# Altium schematic sheet BRD220522.schdoc
size 412 x 216 mm
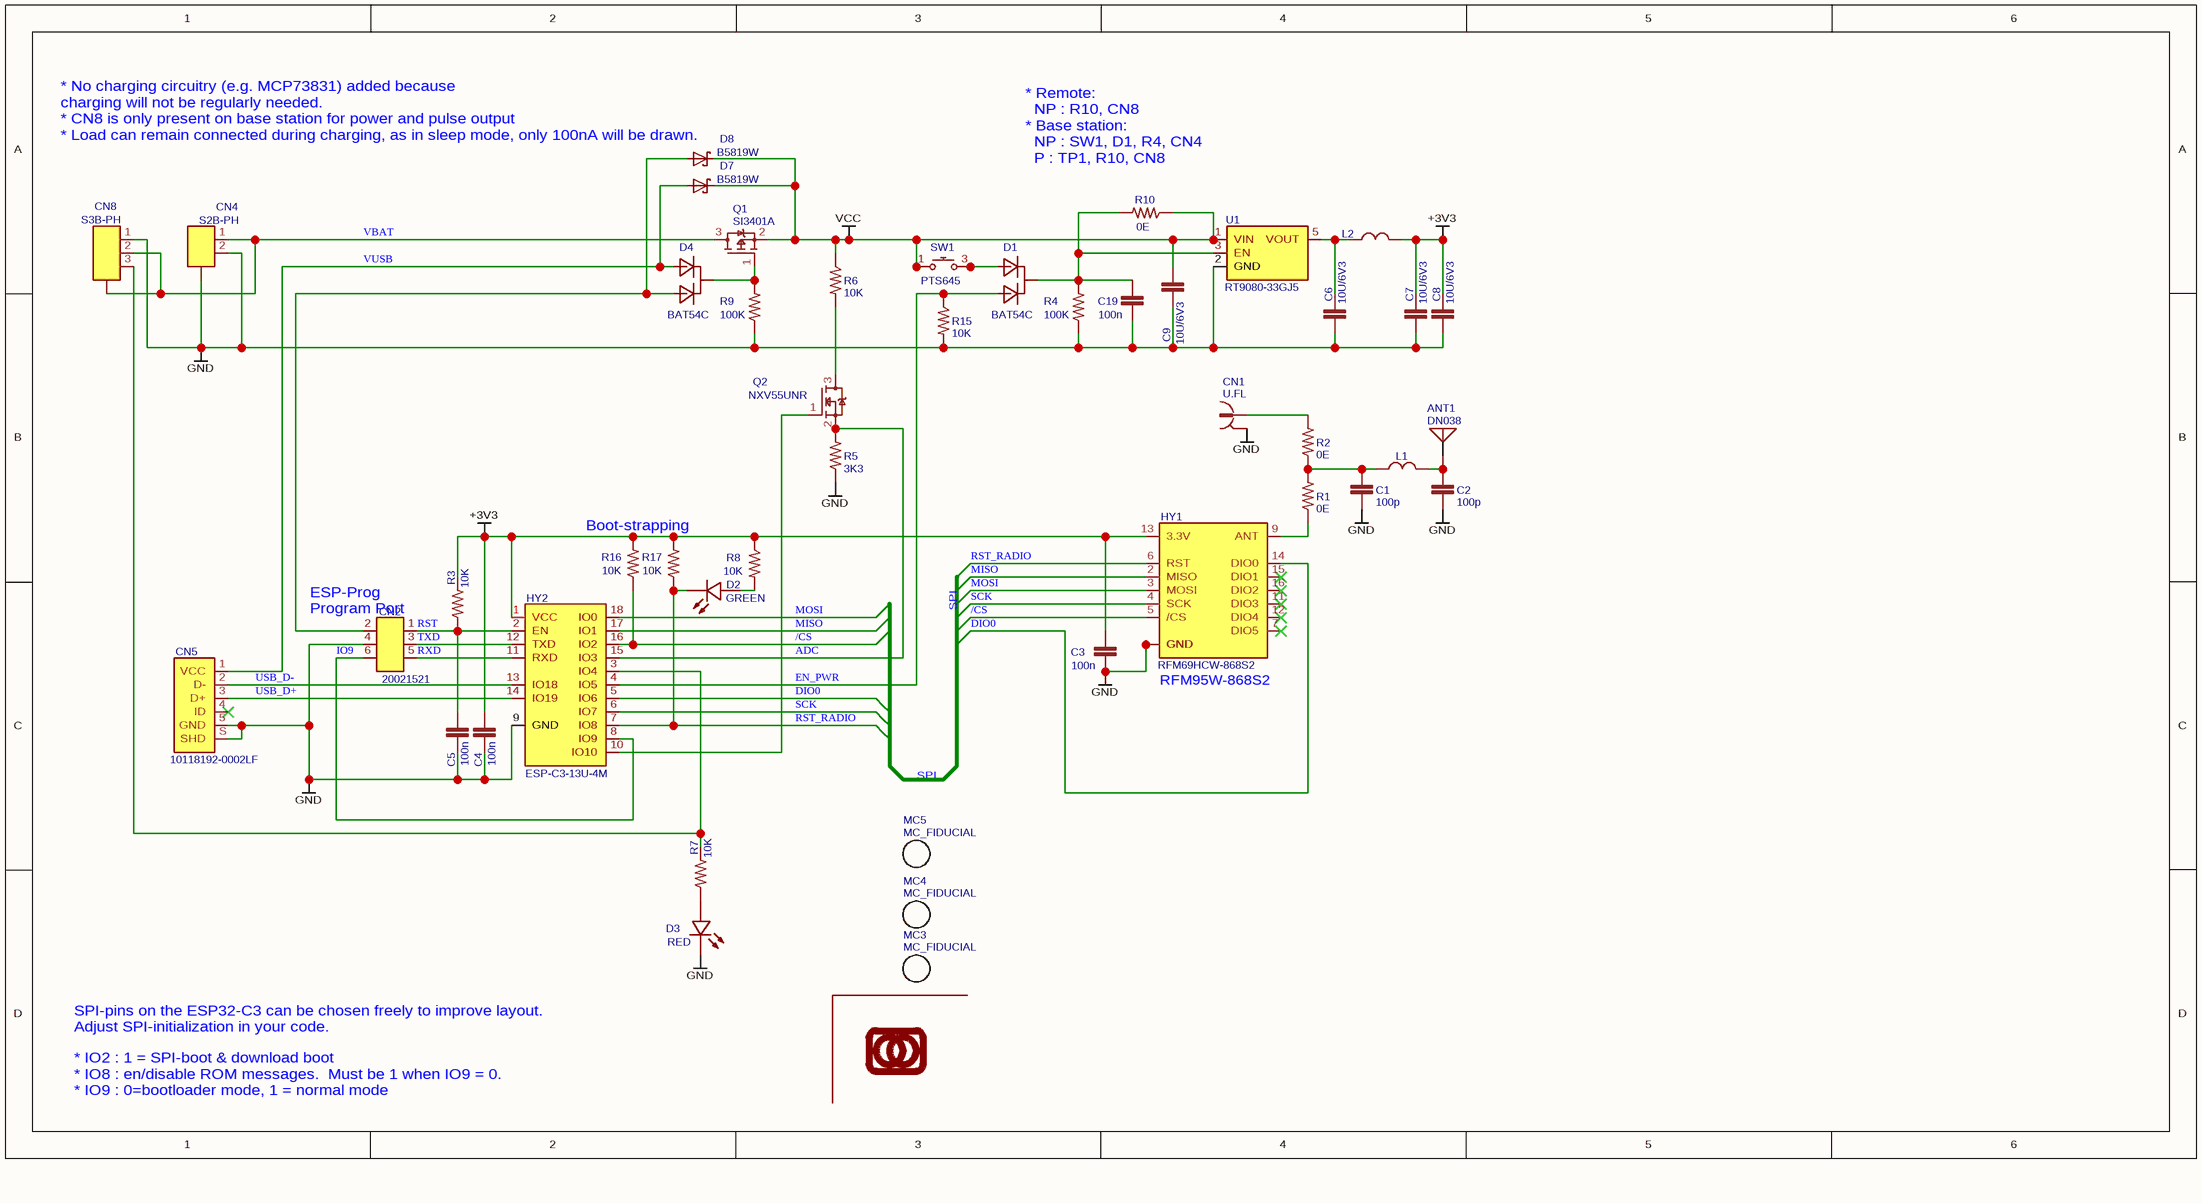
[diagram p0: BRD220522.schdoc]

## Parts
ANT1  DN038  [ANT_DN038]
C1  100p  [CA_0603]
C2  100p  [CA_0603]
C3  100n  [CA_0603]
C4  100n  [CA_0603]
C5  100n  [CA_0603]
C6  10U/6V3  [CA_1206]
C7  10U/6V3  [CA_1206]
C8  10U/6V3  [CA_1206]
C9  10U/6V3  [CA_1206]
C19  100n  [CA_0603]
CN1  U.FL  [CN_ANT-SMD_UFL-R-SMT-1]
CN2  20021521  [CN_HDR_2X3_180D_P127_SMD]
CN4  S2B-PH  [CN_HDR_1X2_90D_P20_JST_S2B-PH-SM4-TB]
CN5  10118192-0002LF  [CN_USB_MICRO_B_AMPHENOL_10118192-0002LF]
CN8  S3B-PH  [CN_HDR_1X3_90D_P25_JST_PH_S3B]
D1  BAT54C  [SC_SOT23-3]
D2  GREEN  [DI_LED_GREEN_0603]
D3  RED  [DI_LED_RED_0603]
D4  BAT54C  [SC_SOT23-3]
D7  B5819W  [DI_SOD123W]
D8  B5819W  [DI_SOD123W]
HY1  RFM69HCW-868S2  [HY_RFM69HCW]
HY2  ESP-C3-13U-4M  [HY_WIRELM-SMD_ESP-C3-13U-2M]
L1  L_unknown  [CL_0603]  (value not drawn)
L2  L_unknown  [CL_0603]  (value not drawn)
MC1  LIEBTRAU_LOGO  [MC_LIEBTRAU_LOGO]  (value not drawn)
MC3  MC_FIDUCIAL  [MC_FIDUCIAL]
MC4  MC_FIDUCIAL  [MC_FIDUCIAL]
MC5  MC_FIDUCIAL  [MC_FIDUCIAL]
Q1  SI3401A  [SC_SOT23-3]
Q2  NXV55UNR  [SC_SOT23-3]
R1  0E  [RE_0603]
R2  0E  [RE_0603]
R3  10K  [RE_0603]
R4  100K  [RE_0603]
R5  3K3  [RE_0603]
R6  10K  [RE_0603]
R7  10K  [RE_0603]
R8  10K  [RE_0603]
R9  100K  [RE_0603]
R10  0E  [RE_0603]
R15  10K  [RE_0603]
R16  10K  [RE_0603]
R17  10K  [RE_0603]
SW1  PTS645  [SW_MOM_6X6]
U1  RT9080-33GJ5  [SC_SOT23-5]

## Nets
+3V3: C3.1 C4.1 C7.1 C8.1 HY1.13(3.3V) HY2.1(VCC) L2.2 R3.2 R8.1 R16.2 R17.2
GND: C1.2 C2.2 C3.2 C4.2 C5.2 C6.2 C7.2 C8.2 C9.2 C19.2 CN1.2 CN2.4 CN4.0 CN4.2 CN5.5(GND) CN5.S(SHD) CN8.1 D3.1(C) HY1.1(GND) HY1.8(GND) HY1.10(GND) HY2.9(GND) R4.1 R5.1 R9.1 R15.2 U1.2(GND)
VCC: C9.1 D7.1(C) D8.1(C) Q1.2(S) R6.1 R10.1 SW1.1 SW1.2 U1.1(VIN)
/CS: HY1.5(/CS) HY2.16(IO2) R16.1
ADC: HY2.15(IO3) Q2.2(S) R5.2
DIO0: HY1.14(DIO0) HY2.5(IO6)
EN_PWR: D1.1(A1) HY2.4(IO5) R15.1
IO9: CN2.6 HY2.8(IO9)
MISO: HY1.2(MISO) HY2.17(IO1)
MOSI: HY1.3(MOSI) HY2.18(IO0)
RST: C5.1 CN2.1 HY2.2(EN) R3.1
RST_RADIO: D2.1(C) HY1.6(RST) HY2.7(IO8) R17.1
RXD: CN2.5 HY2.11(RXD)
SCK: HY1.4(SCK) HY2.6(IO7)
TXD: CN2.3 HY2.12(TXD)
USB_D+: CN5.3(D+) HY2.14(IO19)
USB_D-: CN5.2(D-) HY2.13(IO18)
VBAT: CN4.1 CN8.0 CN8.2 Q1.3(D)
VUSB: CN2.2 CN5.1(VCC) D4.1(A1) D4.2(A2) D7.2(A) D8.2(A)
NetANT1_1: ANT1.1(RADIO) C2.1 L1.2
NetC1_1: C1.1 L1.1 R1.2 R2.1
NetC6_1: C6.1 L2.1 U1.5(VOUT)
NetC19_1: C19.1 D1.3(K) R4.2 R10.2 U1.3(EN)
NetCN1_1: CN1.1 R2.2
NetCN8_3: CN8.3 HY2.3(IO4) R7.2
NetD1_2: D1.2(A2) SW1.3 SW1.4
NetD2_2: D2.2(A) R8.2
NetD3_2: D3.2(A) R7.1
NetD4_3: D4.3(K) Q1.1(G) R9.2
NetHY1_9: HY1.9(ANT) R1.1
NetHY2_10: HY2.10(IO10) Q2.1(G)
NetQ2_3: Q2.3(D) R6.2

Not connected (* = marked no-connect by the designer): CN5 4(ID)*; HY1 7(DIO5)* 11(DIO3)* 12(DIO4)* 15(DIO1)* 16(DIO2)*

## Notes on the sheet
- * No charging circuitry (e.g. MCP73831) added because
  charging will not be regularly needed.
  * CN8 is only present on base station for power and pulse output
  * Load can remain connected during charging, as in sleep mode, only 100nA will be drawn.
- (near R10) * Remote:
  NP : R10, CN8
  * Base station:
  NP : SW1, D1, R4, CN4
  P : TP1, R10, CN8
- (near CN2) ESP-Prog
  Program Port
- Boot-strapping
- SPI
- (near HY1) RFM95W-868S2
- * IO2 : 1 = SPI-boot & download boot
  * IO8 : en/disable ROM messages.  Must be 1 when IO9 = 0.
  * IO9 : 0=bootloader mode, 1 = normal mode
- SPI-pins on the ESP32-C3 can be chosen freely to improve layout.
  Adjust SPI-initialization in your code.

## Library data of the parts
ANT1 = DN038: BOM_Manufacturer: Texas Instruments; Contributor: LieBtrau; BOM_Manufacturer Part: DN038; link: http://www.ti.com/lit/an/swra416/swra416.pdf; spicePre: A; spiceSymbolName: DN038
C1 C2 = 100p: description: 100p 1206 50V; BOM_Supplier Part: C160903; BOM_Supplier: LCSC; spicePre: C; spiceSymbolName: 100p
C3-C5 C19 = 100n: description: 100n 0603 16V; Capacitance: 100nF; BOM_Supplier Part: C80516; BOM_Supplier: LCSC; spicePre: C; spiceSymbolName: 100n_0603
C6-C9 = 10U/6V3: description: 10u 1206 6V3; BOM_Supplier Part: C318761; BOM_Supplier: LCSC; BOM_Digi-Key: 399-3029-1-ND; spicePre: C; spiceSymbolName: 10U/6V3
CN1 = U.FL: description: CONN SMA JACK STR 50OHM EDGE MNT; spicePre: C; spiceSymbolName: CN_COAXU.FL_MALE
CN2 = 20021521: BOM_Manufacturer: Amphenol ICC (FCI); BOM_Manufacturer Part: 20021521-00006T1LF; Contributor: LieBtrau; spicePre: C; spiceSymbolName: 20021521-00006T1LF
CN4 = S2B-PH: TrustedParts: edac/140-502-417-060; BOM_Supplier Part: C3029440; BOM_Supplier: LCSC; spicePre: C; spiceSymbolName: S2B-PH
CN5 = 10118192-0002LF: BOM_Manufacturer Part: Amphenol ICC (FCI); Contributor: LieBtrau; BOM_Manufacturer: 10118192-0002LF; BOM_Supplier: Digi-Key; BOM_Supplier Part: 609-5379-1-ND; spicePre: C; spiceSymbolName: 10118192-0002LF
CN8 = S3B-PH: BOM_Manufacturer: JST Sales America; BOM_Manufacturer Part: S3B-PH-SM4-TB(LF)(SN); TrustedParts: edac/140-503-417-060; Contributor: LieBtrau; BOM_Supplier: LCSC; BOM_Supplier Part: C2764212; BOM_JLCPCB Part Class: Extended Part; spicePre: U; spiceSymbolName: S3B-PH-SM4-TB(LF)(SN)
D1 D4 = BAT54C: BOM_Manufacturer: CJ; BOM_Supplier: LCSC; BOM_Manufacturer Part: BAT54C; image: //image.lceda.cn/szlcsc/C2135.jpg; BOM_Supplier Part: C2135; spicePre: D; spiceSymbolName: BAT54C
D2 = GREEN: BOM_Manufacturer: Kingbright; BOM_Manufacturer Part: APTD1608ZGCK; Contributor: LieBtrau; BOM_Supplier: Digi-Key; BOM_Supplier Part: 754-1805-1-ND; spicePre: D; spiceSymbolName: APTD1608ZGCK
D3 = RED: BOM_Manufacturer: Kingbright; BOM_Manufacturer Part: APTD1608SECK/J4-PF; Contributor: LieBtrau; BOM_Supplier: Digi-Key; BOM_Supplier Part: 754-1802-1-ND; spicePre: D; spiceSymbolName: APTD1608SECK/J4-PF
D7 D8 = B5819W: BOM_Manufacturer: CJ(江苏长电/长晶); BOM_Manufacturer Part: B5819W SL; BOM_Supplier: LCSC; BOM_Supplier Part: C8598; BOM_JLCPCB Part Class: Basic Part; spicePre: D; spiceSymbolName: B5819W
HY1 = RFM69HCW-868S2: BOM_Manufacturer: HopeRF; description: Hope RF RFM69H ISM Transceiver Module; Contributor: LieBtrau; BOM_Manufacturer Part: RFM69HCW-868S2; spicePre: H; spiceSymbolName: RFM69HCW-868S2
HY2 = ESP-C3-13U-4M: BOM_Manufacturer: Ai-Thinker(安信可); Contributor: LCSC; BOM_Supplier: LCSC; BOM_Supplier Part: C2838651; BOM_Manufacturer Part: ESP-C3-13U-4M; BOM_JLCPCB Part Class: Extended Part; spicePre: H; spiceSymbolName: ESP-C3-13U-4M
L1 L2 = L_unknown: Contributor: LieBtrau; spicePre: L; spiceSymbolName: L_unknown
MC1 = LIEBTRAU_LOGO: BOM_Mounted: No; Contributor: LieBtrau; spicePre: M; spiceSymbolName: LIEBTRAU_LOGO
MC3-MC5 = MC_FIDUCIAL: Contributor: LieBtrau; BOM_Mounted: No; BOM_Manufacturer Part: MC_FIDUCIAL; spicePre: M; spiceSymbolName: MC_FIDUCIAL
Q1 = SI3401A: BOM_Manufacturer: Alpha & Omega Semicon; BOM_Manufacturer Part: AO3401A; Contributor: LieBtrau; BOM_Supplier: LCSC; BOM_Supplier Part: C15127; spicePre: Q; spiceSymbolName: SI3401A
R4 R9 = 100K: BOM_Manufacturer: YAGEO; BOM_Manufacturer Part: RE0603FRE07100KL; Contributor: LieBtrau; BOM_Supplier: Digi-Key; BOM_Supplier Part: 13-RE0603FRE07100KLCT-ND; Value: 100K; spicePre: R; spiceSymbolName: RE0603FRE07100KL
R5 = 3K3: description: Bourns CR1206; BOM_Supplier Part: CR0603-FX-3301ELF; BOM_Supplier: Digi-Key; spicePre: R; spiceSymbolName: 3K3_0603
SW1 = PTS645: BOM_Manufacturer: C&K; BOM_Manufacturer Part: PTS645SK50SMTR92LFS; Contributor: LieBtrau; BOM_Supplier: LCSC; BOM_Supplier Part: C221872; BOM_JLCPCB Part Class: Extended Part; spicePre: S; spiceSymbolName: PTS645SK50SMTR92LFS
U1 = RT9080-33GJ5: BOM_Manufacturer: Richtek Tech; Contributor: LieBtrau; BOM_Supplier: LCSC; BOM_Supplier Part: C841192; BOM_Manufacturer Part: RT9080-33GJ5; BOM_JLCPCB Part Class: Extended Part; link: https://www.trustedparts.com/en/part/richtek/RT9080-33GJ5; spicePre: U; spiceSymbolName: RT9080-33GJ5
Q2 = NXV55UNR: BOM_Supplier Part: NXV55UNR; BOM_Supplier: Digi-Key; spicePre: Q; spiceSymbolName: NXV55UNR
R1 R2 R10 = 0E: BOM_Supplier Part: 311-0.0GRCT-ND; BOM_Supplier: Digi-Key; spicePre: R; spiceSymbolName: 0E/0603
R3 R6-R8 R15-R17 = 10K: BOM_Supplier Part: RNCP0603FTD10K0; BOM_Supplier: Digi-Key; spicePre: R; spiceSymbolName: 10K/0603; Resistance: 10K